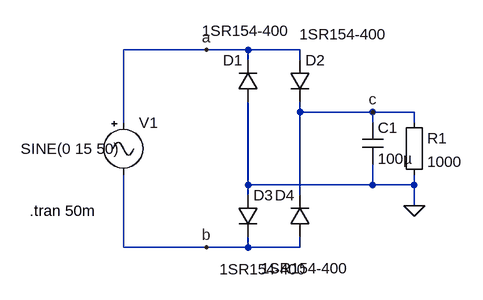
[diagram p0: schematic rectifier_bridge.asc]
rectifier_bridge.asc, the LTspice schematic file:
Version 4
SHEET 1 880 680
WIRE -416 32 -544 32
WIRE -352 32 -416 32
WIRE -272 32 -352 32
WIRE -352 48 -352 32
WIRE -272 48 -272 32
WIRE -272 128 -272 112
WIRE -160 128 -272 128
WIRE -96 128 -160 128
WIRE -544 144 -544 32
WIRE -160 144 -160 128
WIRE -96 144 -96 128
WIRE -352 240 -352 112
WIRE -160 240 -160 208
WIRE -160 240 -352 240
WIRE -96 240 -96 224
WIRE -96 240 -160 240
WIRE -352 256 -352 240
WIRE -272 256 -272 128
WIRE -96 272 -96 240
WIRE -544 336 -544 224
WIRE -416 336 -544 336
WIRE -352 336 -352 320
WIRE -352 336 -416 336
WIRE -272 336 -272 320
WIRE -272 336 -352 336
FLAG -96 272 0
FLAG -416 32 a
FLAG -160 128 c
FLAG -416 336 b
SYMBOL diode -336 112 R180
WINDOW 0 24 64 Left 2
WINDOW 3 -49 109 Left 2
SYMATTR InstName D1
SYMATTR Value 1SR154-400
SYMBOL Misc\\EuropeanResistor -112 128 R0
SYMATTR InstName R1
SYMATTR Value 1000
SYMBOL Misc\\signal -544 128 R0
WINDOW 123 0 0 Left 2
WINDOW 39 0 0 Left 2
WINDOW 3 -158 56 Left 2
SYMATTR Value SINE(0 15 50)
SYMATTR InstName V1
SYMBOL diode -288 48 R0
WINDOW 3 15 -40 Left 2
SYMATTR Value 1SR154-400
SYMATTR InstName D2
SYMBOL diode -368 256 R0
WINDOW 3 -28 114 Left 2
SYMATTR Value 1SR154-400
SYMATTR InstName D3
SYMBOL diode -256 320 R180
WINDOW 0 24 64 Left 2
WINDOW 3 -60 -48 Left 2
SYMATTR InstName D4
SYMATTR Value 1SR154-400
SYMBOL cap -176 144 R0
SYMATTR InstName C1
SYMATTR Value 100µ
TEXT -688 280 Left 2 !.tran 50m

The netlist it stands for:
* rectifier_bridge.asc
D1 0 a 1SR154-400
R1 c 0 1000
V1 a b SINE(0 15 50)
D2 a c 1SR154-400
D3 0 b 1SR154-400
D4 b c 1SR154-400
C1 c 0 100µ
.model D D
.lib standard.dio
.tran 50m
.backanno
.end